# Altium schematic sheet MAIN_BOARD.SchDoc
size E; SheetNumber: 1; SheetTotal: 13
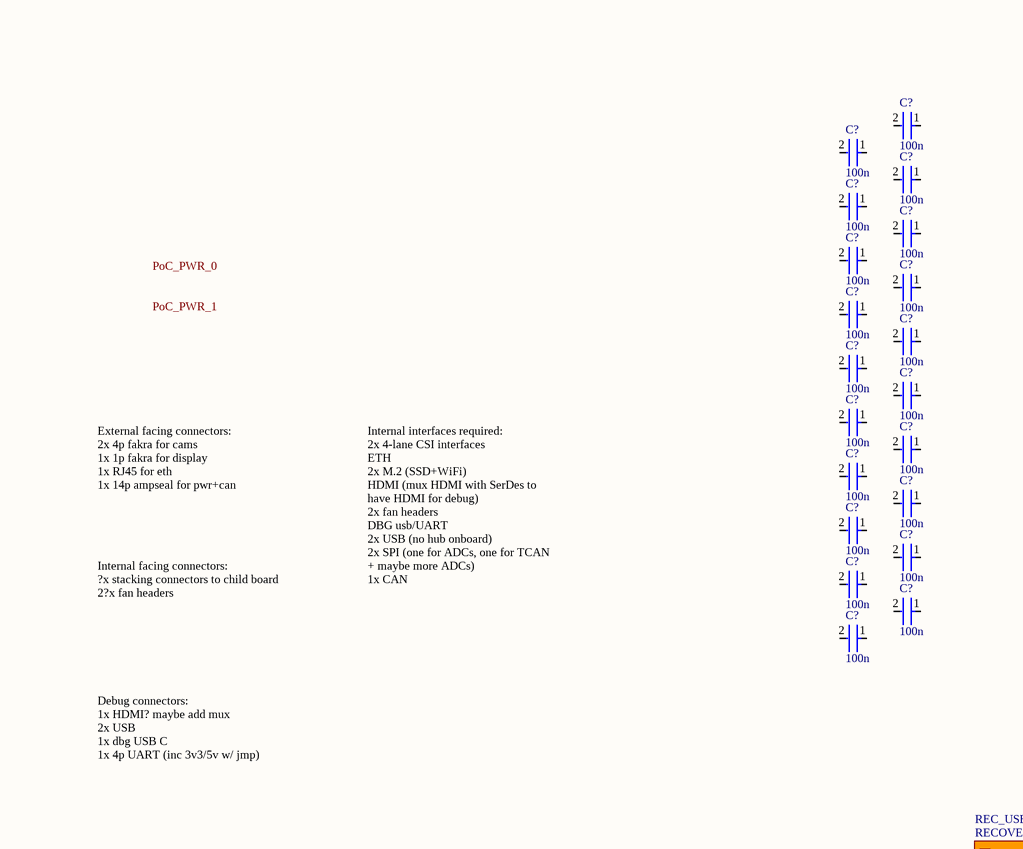
[diagram p0: MAIN_BOARD.SchDoc, top left]
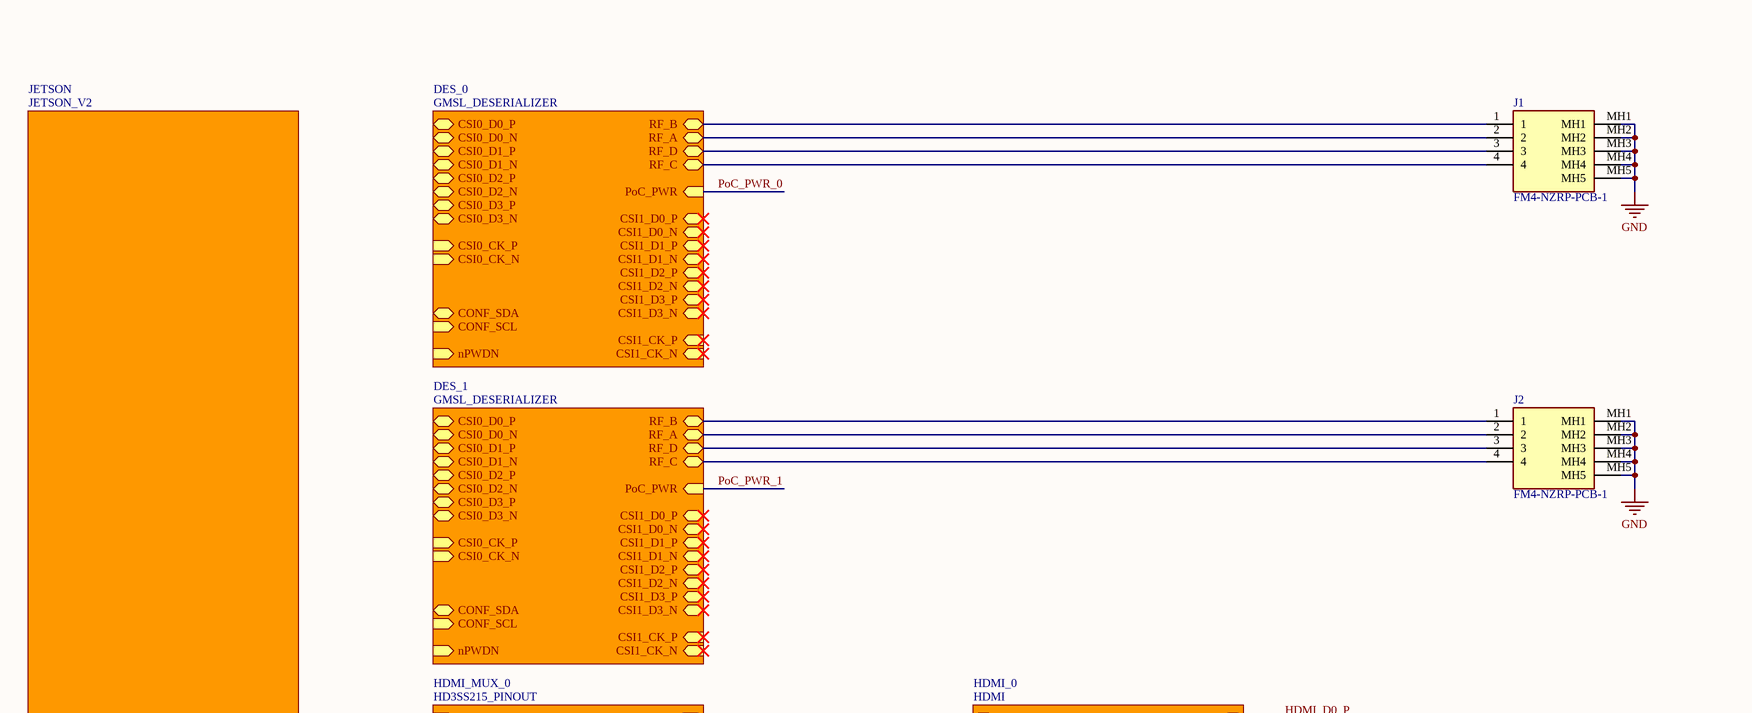
[diagram p1: MAIN_BOARD.SchDoc, top middle]
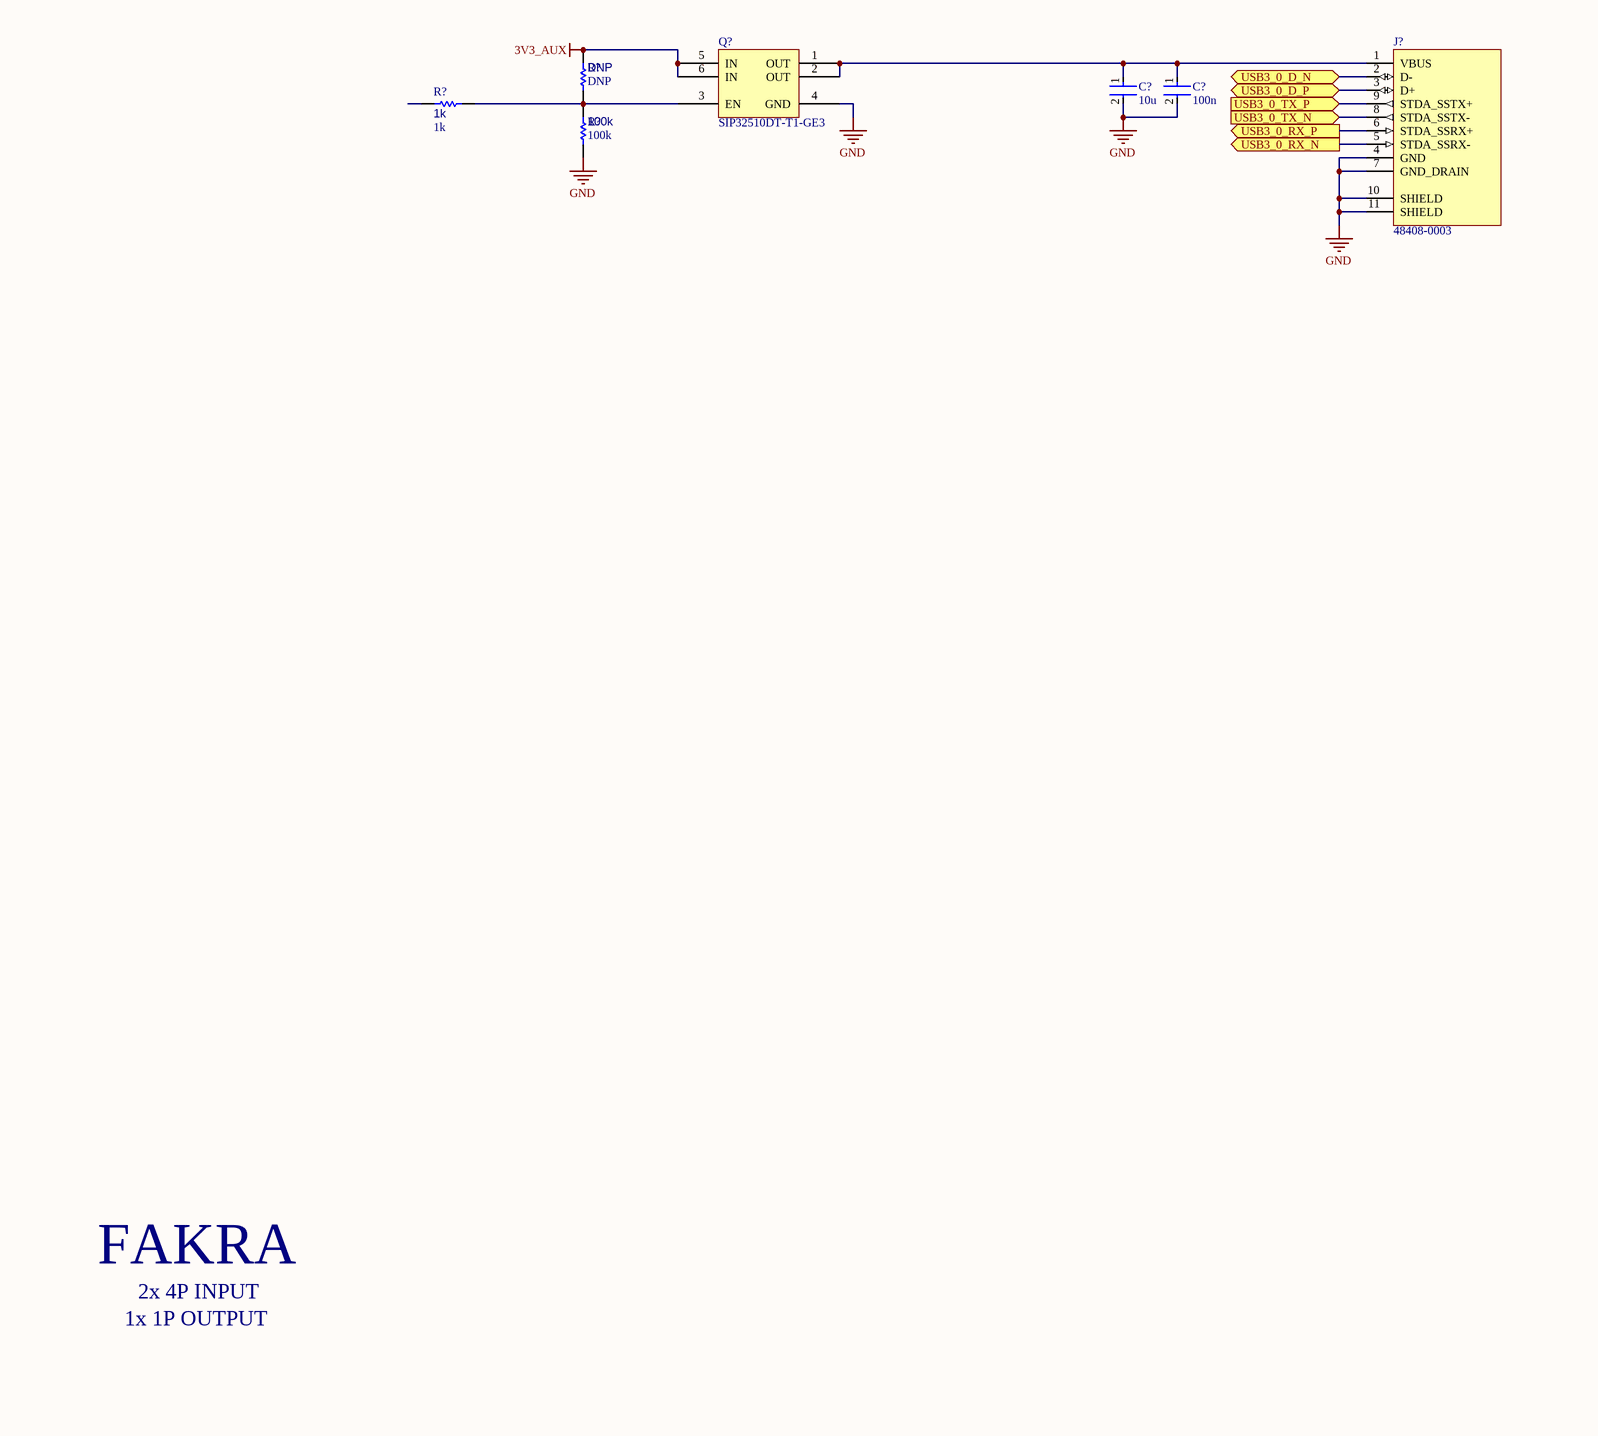
[diagram p2: MAIN_BOARD.SchDoc, top right]
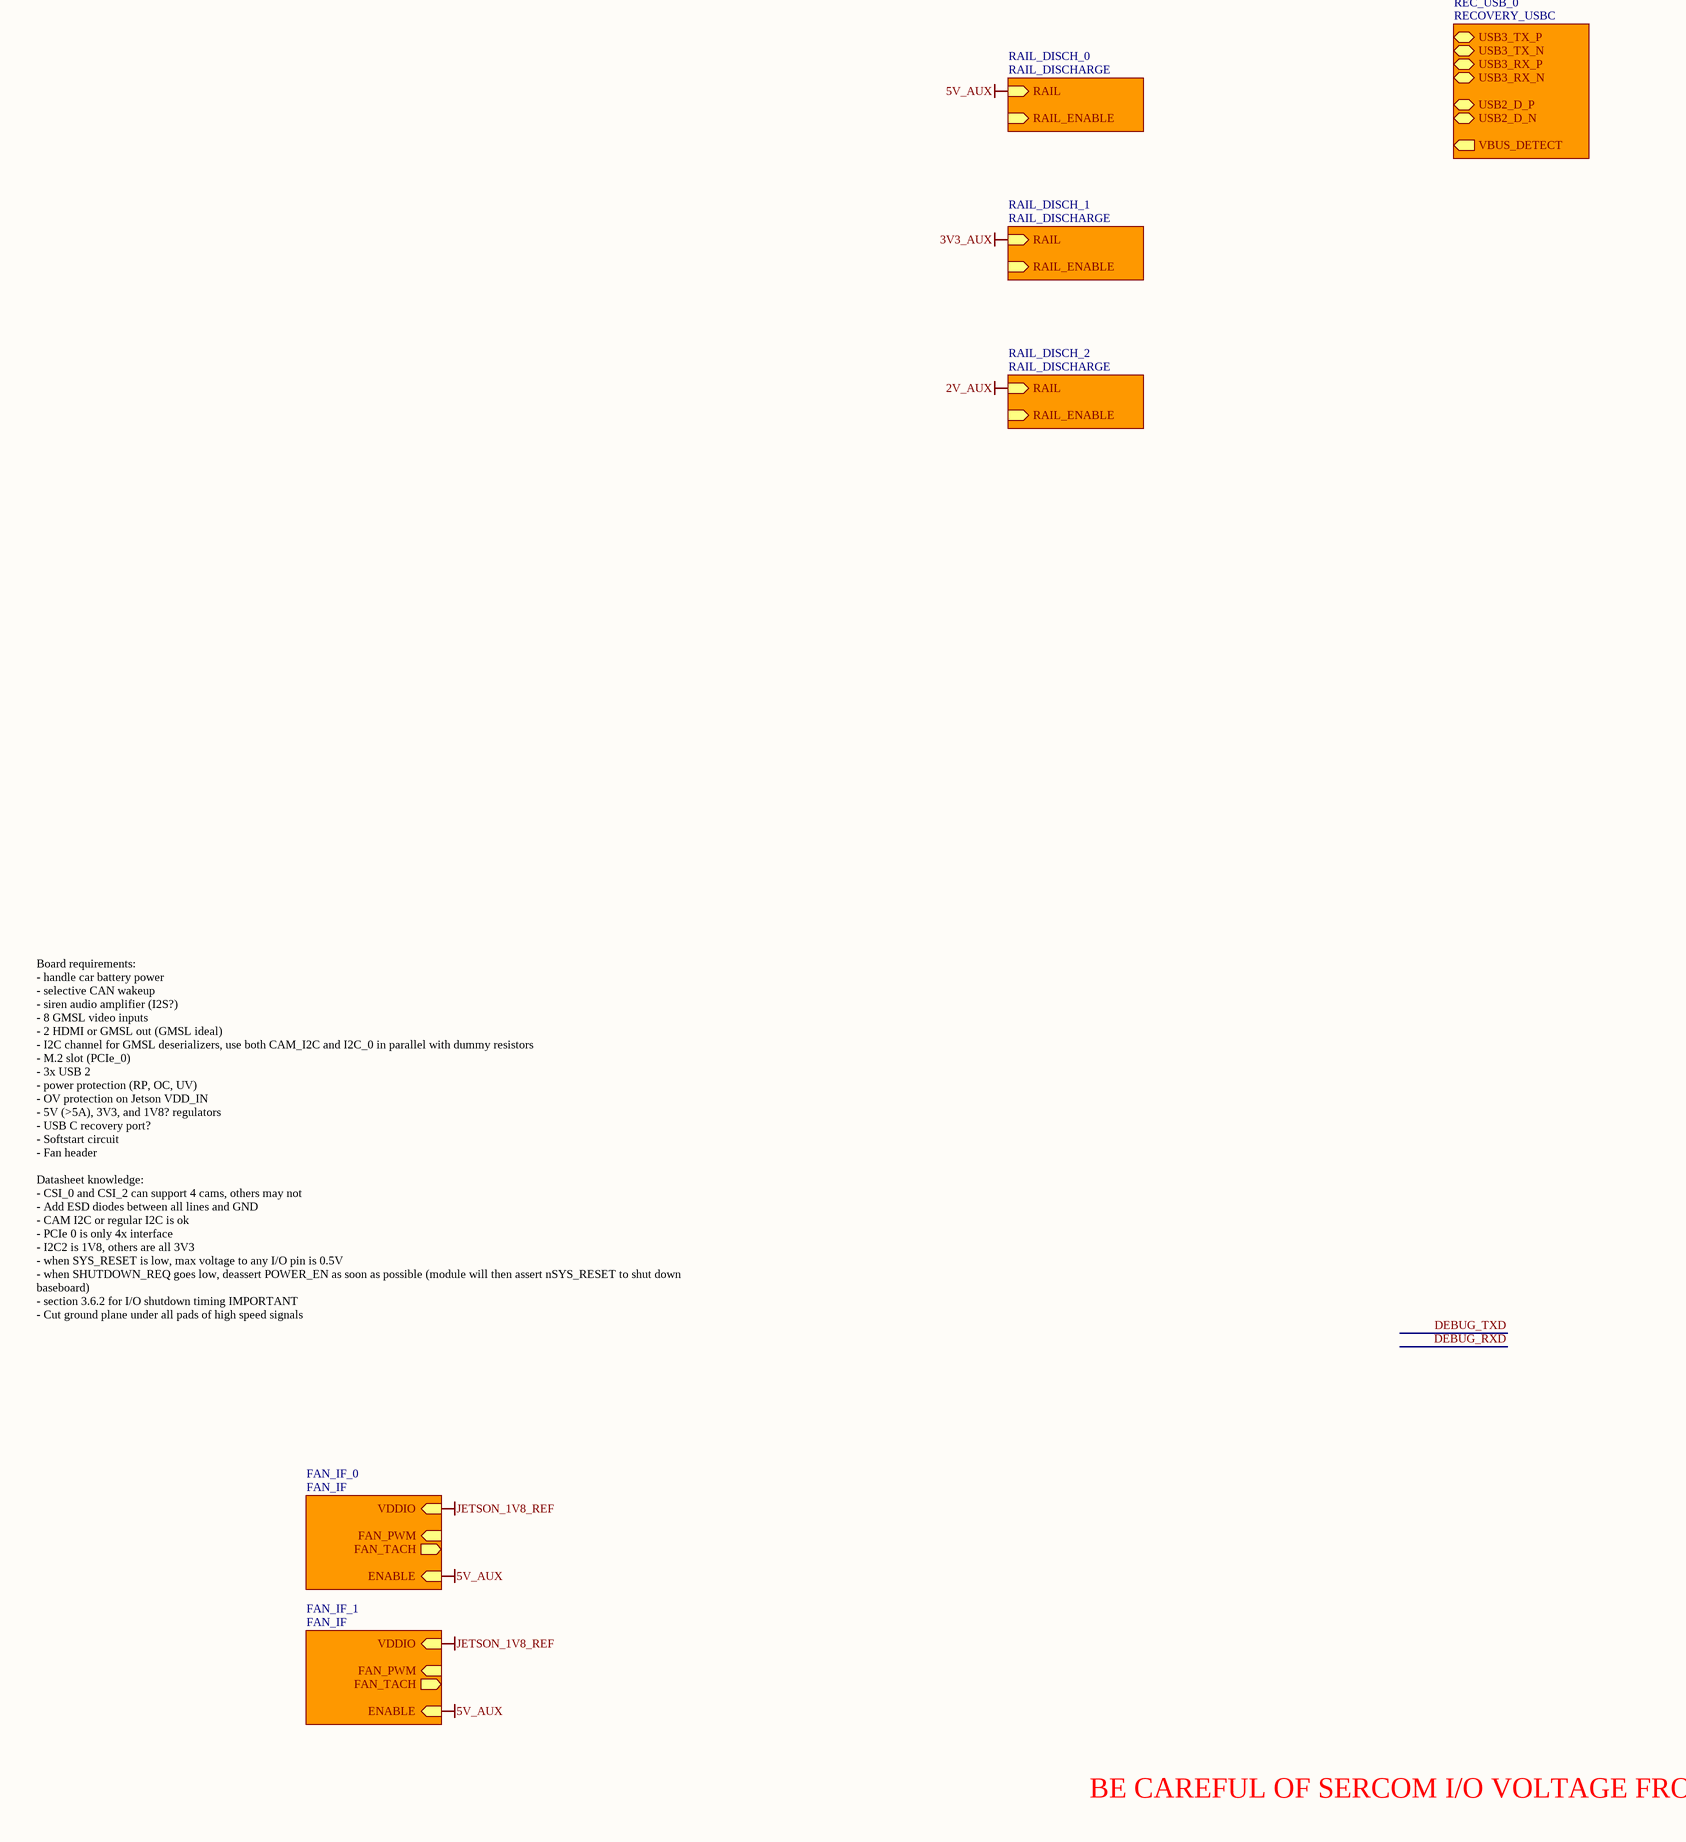
[diagram p3: MAIN_BOARD.SchDoc, bottom left]
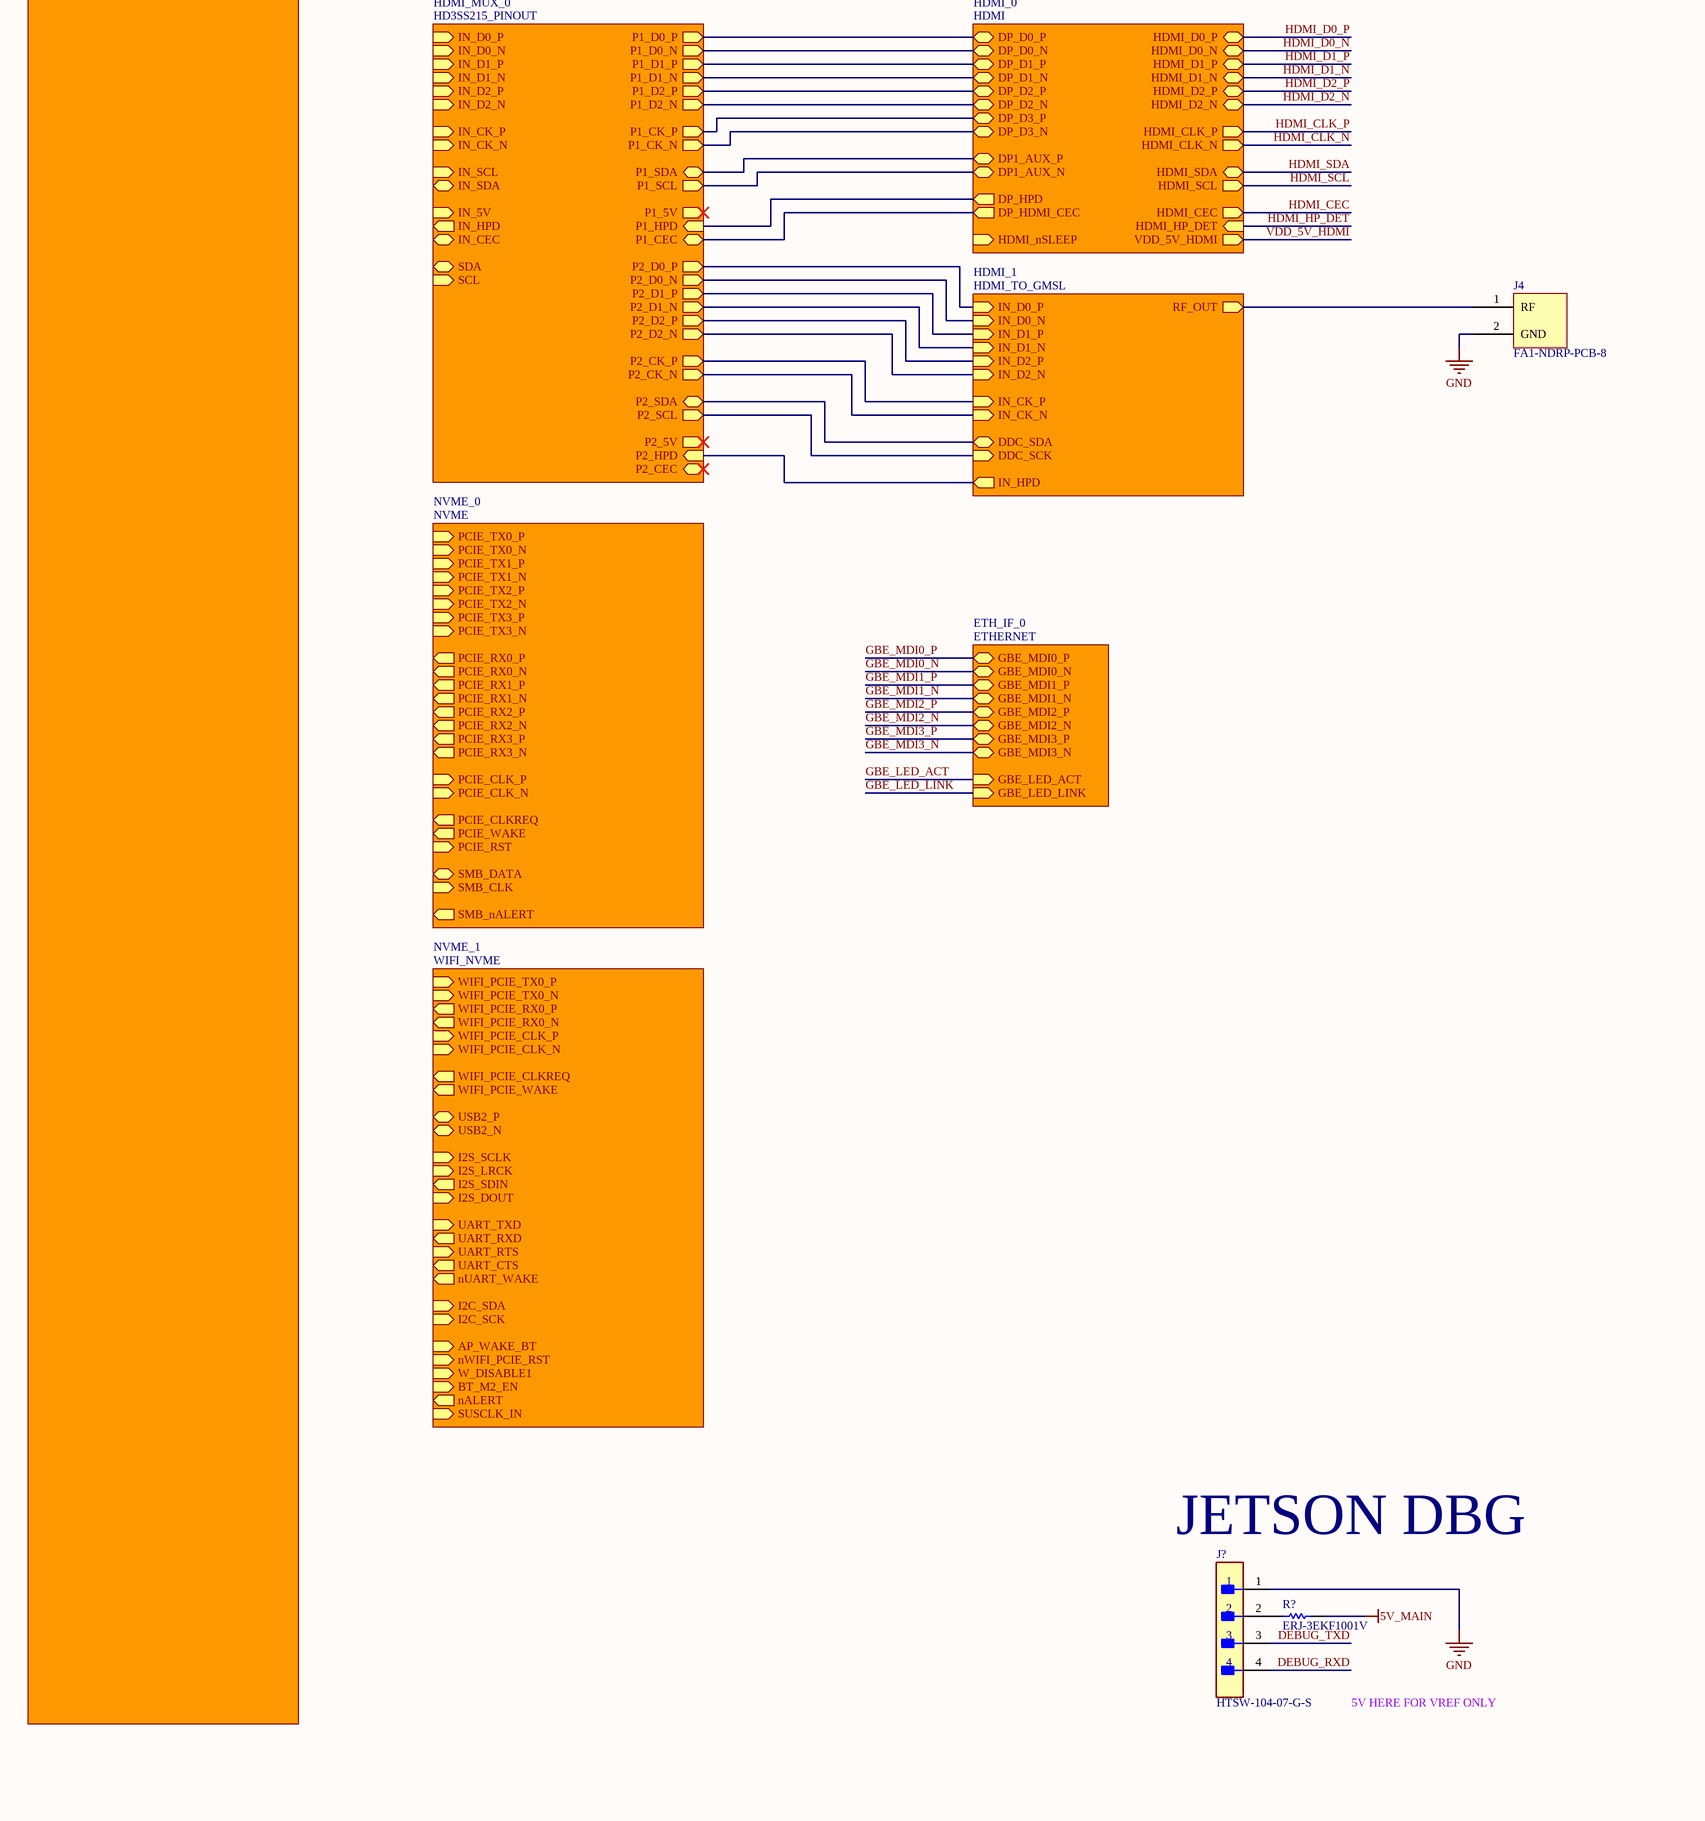
[diagram p4: MAIN_BOARD.SchDoc, bottom middle]
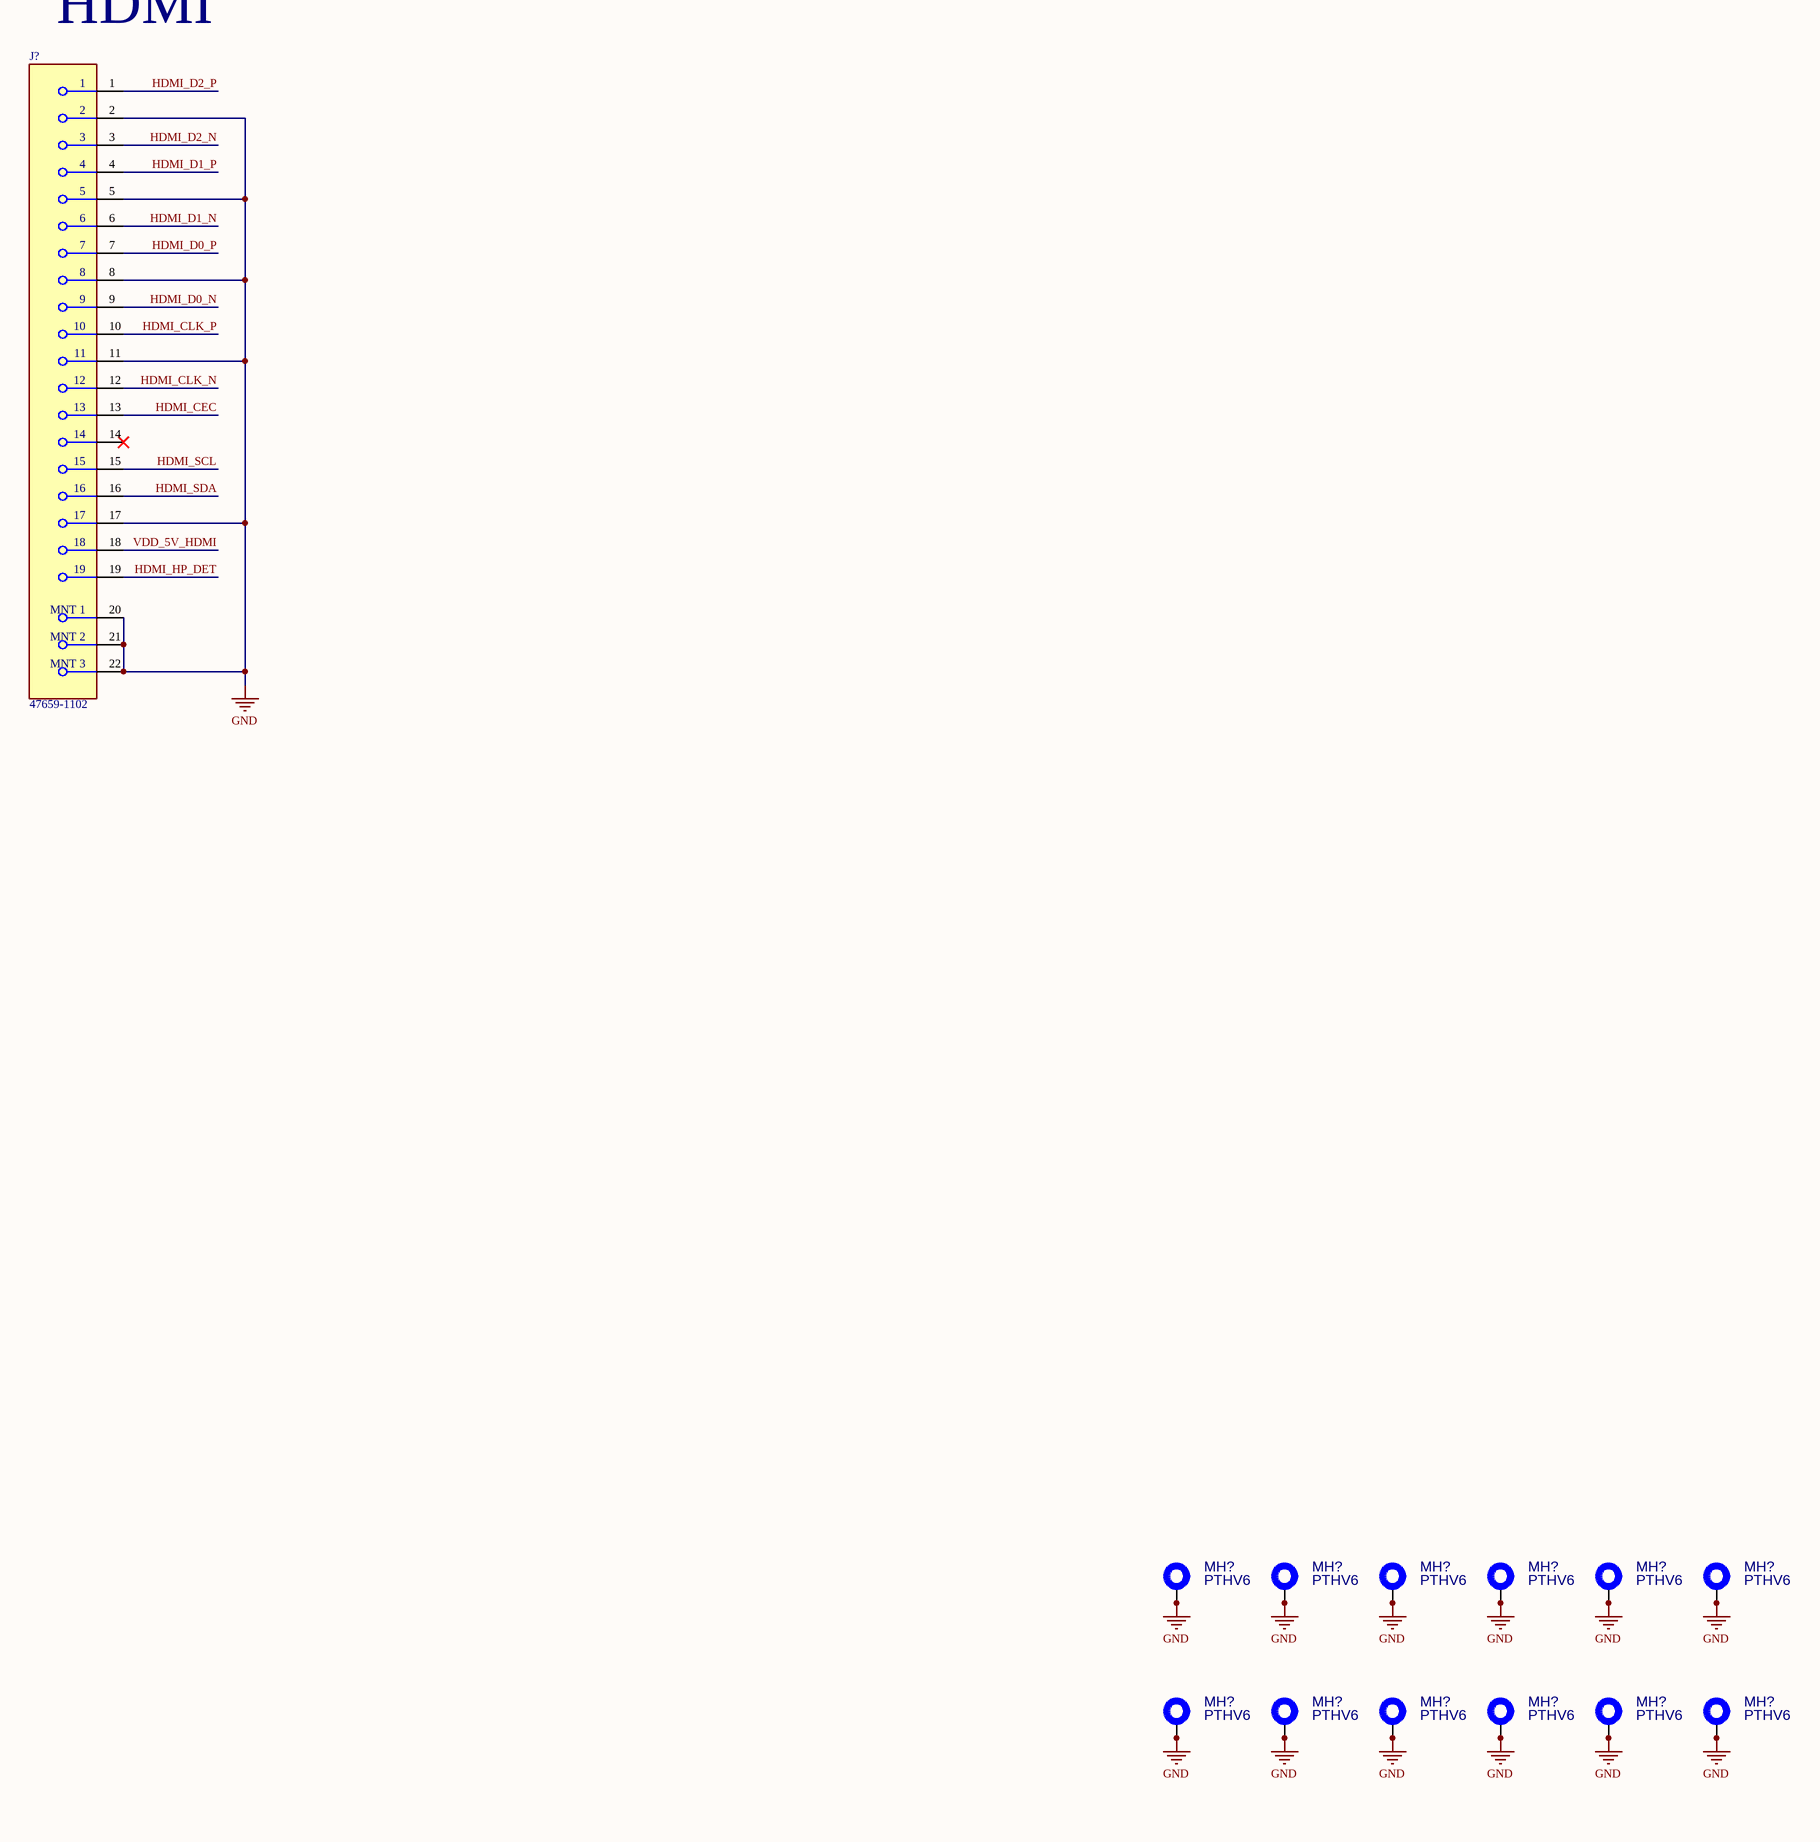
[diagram p5: MAIN_BOARD.SchDoc, bottom right]

## Parts
(Parts that share a designator on the sheet are numbered #1, #2 ... from top to bottom, then left to right.)
C?#1  10u  [FP-0402-L_1_0_0_05-W_0_5-IPC_A]
C?#2  100n  [FP-0402-L_1_0_0_05-W_0_5-IPC_A]
C?#3  100n  [FP-0402-L_1_0_0_05-W_0_5-IPC_A]
C?#4  100n  [FP-0402-L_1_0_0_05-W_0_5-IPC_A]
C?#5  100n  [FP-0402-L_1_0_0_05-W_0_5-IPC_A]
C?#6  100n  [FP-0402-L_1_0_0_05-W_0_5-IPC_A]
C?#7  100n  [FP-0402-L_1_0_0_05-W_0_5-IPC_A]
C?#8  100n  [FP-0402-L_1_0_0_05-W_0_5-IPC_A]
C?#9  100n  [FP-0402-L_1_0_0_05-W_0_5-IPC_A]
C?#10  100n  [FP-0402-L_1_0_0_05-W_0_5-IPC_A]
C?#11  100n  [FP-0402-L_1_0_0_05-W_0_5-IPC_A]
C?#12  100n  [FP-0402-L_1_0_0_05-W_0_5-IPC_A]
C?#13  100n  [FP-0402-L_1_0_0_05-W_0_5-IPC_A]
C?#14  100n  [FP-0402-L_1_0_0_05-W_0_5-IPC_A]
C?#15  100n  [FP-0402-L_1_0_0_05-W_0_5-IPC_A]
C?#16  100n  [FP-0402-L_1_0_0_05-W_0_5-IPC_A]
C?#17  100n  [FP-0402-L_1_0_0_05-W_0_5-IPC_A]
C?#18  100n  [FP-0402-L_1_0_0_05-W_0_5-IPC_A]
C?#19  100n  [FP-0402-L_1_0_0_05-W_0_5-IPC_A]
C?#20  100n  [FP-0402-L_1_0_0_05-W_0_5-IPC_A]
C?#21  100n  [FP-0402-L_1_0_0_05-W_0_5-IPC_A]
C?#22  100n  [FP-0402-L_1_0_0_05-W_0_5-IPC_A]
J1  FM4-NZRP-PCB-1  [FM4-NZRP-PCB-1-Footprint-1]
J2  FM4-NZRP-PCB-1  [FM4-NZRP-PCB-1-Footprint-1]
J4  FA1-NDRP-PCB-8  [FA1-NDRP-PCB-8-Footprint-1]
J?#1  48408-0003  [MOLX-48408-0003_V]
J?#2  47659-1102  [FP-47659-1102-MFG]
J?#3  HTSW-104-07-G-S  [FP-HTSW-104-07-G-S-MFG]
MH?#1  PTHV6  [PTHV6 M2]  (net tie, no BOM)
MH?#2  PTHV6  [PTHV6 M2]  (net tie, no BOM)
MH?#3  PTHV6  [PTHV6 M2]  (net tie, no BOM)
MH?#4  PTHV6  [PTHV6 M2]  (net tie, no BOM)
MH?#5  PTHV6  [PTHV6 M2]  (net tie, no BOM)
MH?#6  PTHV6  [PTHV6 M2]  (net tie, no BOM)
MH?#7  PTHV6  [PTHV6 M2]  (net tie, no BOM)
MH?#8  PTHV6  [PTHV6 M2]  (net tie, no BOM)
MH?#9  PTHV6  [PTHV6 M2]  (net tie, no BOM)
MH?#10  PTHV6  [PTHV6 M2]  (net tie, no BOM)
MH?#11  PTHV6  [PTHV6 M2]  (net tie, no BOM)
MH?#12  PTHV6  [PTHV6 M2]  (net tie, no BOM)
Q?  SIP32510DT-T1-GE3  [SOT95P284X110-6N]
R?#1  DNP  [R0603B]
R?#2  1k  [R0603B]
R?#3  100k  [R0603B]
R?#4  ERJ-3EKF1001V  [RESC1608X55X30LL15T15]

## Sub-sheets
DES_0 = GMSL_DESERIALIZER: CSI0_D0_P (bidir), CSI0_D0_N (bidir), CSI0_D1_P (bidir), CSI0_D1_N (bidir), CSI0_D2_P (bidir), CSI0_D2_N (bidir), CSI0_D3_P (bidir), CSI0_D3_N (bidir), CSI0_CK_P (in), CSI0_CK_N (in), PoC_PWR (in), RF_B (bidir), RF_A (bidir), RF_C (bidir), RF_D (bidir), CSI1_D0_P (bidir), CSI1_D0_N (bidir), CSI1_D1_P (bidir), CSI1_D1_N (bidir), CSI1_D2_P (bidir), CSI1_D2_N (bidir), CSI1_D3_P (bidir), CSI1_D3_N (bidir), CSI1_CK_P (in), CSI1_CK_N (in), nPWDN (in), CONF_SDA (bidir), CONF_SCL (in)
DES_1 = GMSL_DESERIALIZER: CSI0_D0_P (bidir), CSI0_D0_N (bidir), CSI0_D1_P (bidir), CSI0_D1_N (bidir), CSI0_D2_P (bidir), CSI0_D2_N (bidir), CSI0_D3_P (bidir), CSI0_D3_N (bidir), CSI0_CK_P (in), CSI0_CK_N (in), PoC_PWR (in), RF_B (bidir), RF_A (bidir), RF_C (bidir), RF_D (bidir), CSI1_D0_P (bidir), CSI1_D0_N (bidir), CSI1_D1_P (bidir), CSI1_D1_N (bidir), CSI1_D2_P (bidir), CSI1_D2_N (bidir), CSI1_D3_P (bidir), CSI1_D3_N (bidir), CSI1_CK_P (in), CSI1_CK_N (in), nPWDN (in), CONF_SDA (bidir), CONF_SCL (in)
ETH_IF_0 = ETHERNET: GBE_MDI0_P (bidir), GBE_MDI0_N (bidir), GBE_MDI1_P (bidir), GBE_MDI1_N (bidir), GBE_MDI2_P (bidir), GBE_MDI2_N (bidir), GBE_MDI3_P (bidir), GBE_MDI3_N (bidir), GBE_LED_ACT (in), GBE_LED_LINK (in)
FAN_IF_0 = FAN_IF: FAN_PWM (in), FAN_TACH (out), VDDIO (in), ENABLE (in)
FAN_IF_1 = FAN_IF: FAN_PWM (in), FAN_TACH (out), VDDIO (in), ENABLE (in)
HDMI_0 = HDMI: DP_D0_P (bidir), DP_D0_N (bidir), DP_D1_P (bidir), DP_D1_N (bidir), DP_D2_P (bidir), DP_D2_N (bidir), DP_D3_P (bidir), DP_D3_N (bidir), DP1_AUX_P (bidir), DP1_AUX_N (bidir), DP_HDMI_CEC (out), DP_HPD (out), HDMI_nSLEEP (in), HDMI_D0_P (bidir), HDMI_D0_N (bidir), HDMI_D1_P (bidir), HDMI_D1_N (bidir), HDMI_D2_P (bidir), HDMI_D2_N (bidir), HDMI_CLK_P (out), HDMI_CLK_N (out), HDMI_SDA (bidir), HDMI_SCL (out), HDMI_CEC (out), HDMI_HP_DET (in), VDD_5V_HDMI (out)
HDMI_1 = HDMI_TO_GMSL: IN_D0_P (in), IN_D0_N (in), IN_D1_P (in), IN_D1_N (in), IN_D2_P (in), IN_D2_N (in), IN_CK_N (in), IN_CK_P (in), DDC_SCK (in), DDC_SDA (bidir), IN_HPD (out), RF_OUT (out)
HDMI_MUX_0 = HD3SS215_PINOUT: IN_D0_P (in), IN_D0_N (in), IN_D1_P (in), IN_D1_N (in), IN_D2_P (in), IN_D2_N (in), IN_CK_N (in), IN_CK_P (in), IN_SCL (in), IN_SDA (bidir), IN_5V (in), IN_HPD (out), IN_CEC (bidir), P1_D0_P (out), P1_D0_N (out), P1_D1_P (out), P1_D1_N (out), P1_D2_P (out), P1_D2_N (out), P1_CK_P (out), P1_CK_N (out), P1_SDA (bidir), P1_SCL (out), P1_5V (out), P1_HPD (in), P1_CEC (bidir), P2_D0_P (out), P2_D0_N (out), P2_D1_P (out), P2_D1_N (out), P2_D2_P (out), P2_D2_N (out), P2_CK_P (out), P2_CK_N (out), SDA (bidir), SCL (in), P2_SDA (bidir), P2_SCL (out), P2_5V (out), P2_HPD (in), P2_CEC (bidir)
JETSON = JETSON_V2: no entries
NVME_0 = NVME: SMB_DATA (bidir), SMB_CLK (in), SMB_nALERT (out), PCIE_TX3_N (in), PCIE_TX3_P (in), PCIE_TX2_N (in), PCIE_TX2_P (in), PCIE_TX1_N (in), PCIE_TX1_P (in), PCIE_TX0_N (in), PCIE_TX0_P (in), PCIE_RX3_N (out), PCIE_RX3_P (out), PCIE_RX2_N (out), PCIE_RX2_P (out), PCIE_RX1_N (out), PCIE_RX1_P (out), PCIE_RX0_N (out), PCIE_RX0_P (out), PCIE_CLK_N (in), PCIE_CLK_P (in), PCIE_RST (in), PCIE_CLKREQ (out), PCIE_WAKE (out)
NVME_1 = WIFI_NVME: WIFI_PCIE_TX0_P (in), WIFI_PCIE_TX0_N (in), WIFI_PCIE_RX0_P (out), WIFI_PCIE_RX0_N (out), WIFI_PCIE_CLK_P (in), WIFI_PCIE_CLK_N (in), WIFI_PCIE_CLKREQ (out), WIFI_PCIE_WAKE (out), USB2_P (bidir), USB2_N (bidir), I2S_SCLK (in), I2S_LRCK (in), I2S_SDIN (out), I2S_DOUT (in), nUART_WAKE (out), UART_RXD (out), UART_TXD (in), UART_RTS (in), UART_CTS (out), AP_WAKE_BT (in), SUSCLK_IN (in), I2C_SCK (in), I2C_SDA (in), nALERT (out), nWIFI_PCIE_RST (in), W_DISABLE1 (in), BT_M2_EN (in)
RAIL_DISCH_0 = RAIL_DISCHARGE: RAIL (in), RAIL_ENABLE (in)
RAIL_DISCH_1 = RAIL_DISCHARGE: RAIL (in), RAIL_ENABLE (in)
RAIL_DISCH_2 = RAIL_DISCHARGE: RAIL (in), RAIL_ENABLE (in)
REC_USB_0 = RECOVERY_USBC: VBUS_DETECT (out), USB3_TX_P (bidir), USB3_TX_N (bidir), USB3_RX_P (bidir), USB3_RX_N (bidir), USB2_D_P (bidir), USB2_D_N (bidir)

## Ports
USB3_0_D_N (bidir), USB3_0_D_P (bidir), USB3_0_RX_N (out), USB3_0_RX_P (out), USB3_0_TX_N (in), USB3_0_TX_P (in)

## Nets
2V_AUX: sheet RAIL_DISCH_2/RAIL
3V3_AUX: Q?.5(IN) Q?.6(IN) R?#1.2 ; sheet RAIL_DISCH_1/RAIL
5V_AUX: sheet FAN_IF_0/ENABLE, sheet FAN_IF_1/ENABLE, sheet RAIL_DISCH_0/RAIL
5V_MAIN: R?#4.1
GND: C?#1.2 C?#2.2 J1.MH1 J1.MH2 J1.MH3 J1.MH4 J1.MH5 J2.MH1 J2.MH2 J2.MH3 J2.MH4 J2.MH5 J4.2(GND) J?#1.4(GND) J?#1.7(GND_DRAIN) J?#1.10(SHIELD) J?#1.11(SHIELD) J?#2.2 J?#2.5 J?#2.8 J?#2.11 J?#2.17 J?#2.20(MNT_1) J?#2.21(MNT_2) J?#2.22(MNT_3) J?#3.1 MH?#1.1(MH) MH?#1.2(V1) MH?#1.3(V2) MH?#1.4(V3) MH?#1.5(V4) MH?#1.6(V5) MH?#1.7(V6) MH?#2.1(MH) MH?#2.2(V1) MH?#2.3(V2) MH?#2.4(V3) MH?#2.5(V4) MH?#2.6(V5) MH?#2.7(V6) MH?#3.1(MH) MH?#3.2(V1) MH?#3.3(V2) MH?#3.4(V3) MH?#3.5(V4) MH?#3.6(V5) MH?#3.7(V6) MH?#4.1(MH) MH?#4.2(V1) MH?#4.3(V2) MH?#4.4(V3) MH?#4.5(V4) MH?#4.6(V5) MH?#4.7(V6) MH?#5.1(MH) MH?#5.2(V1) MH?#5.3(V2) MH?#5.4(V3) MH?#5.5(V4) MH?#5.6(V5) MH?#5.7(V6) MH?#6.1(MH) MH?#6.2(V1) MH?#6.3(V2) MH?#6.4(V3) MH?#6.5(V4) MH?#6.6(V5) MH?#6.7(V6) MH?#7.1(MH) MH?#7.2(V1) MH?#7.3(V2) MH?#7.4(V3) MH?#7.5(V4) MH?#7.6(V5) MH?#7.7(V6) MH?#8.1(MH) MH?#8.2(V1) MH?#8.3(V2) MH?#8.4(V3) MH?#8.5(V4) MH?#8.6(V5) MH?#8.7(V6) MH?#9.1(MH) MH?#9.2(V1) MH?#9.3(V2) MH?#9.4(V3) MH?#9.5(V4) MH?#9.6(V5) MH?#9.7(V6) MH?#10.1(MH) MH?#10.2(V1) MH?#10.3(V2) MH?#10.4(V3) MH?#10.5(V4) MH?#10.6(V5) MH?#10.7(V6) MH?#11.1(MH) MH?#11.2(V1) MH?#11.3(V2) MH?#11.4(V3) MH?#11.5(V4) MH?#11.6(V5) MH?#11.7(V6) MH?#12.1(MH) MH?#12.2(V1) MH?#12.3(V2) MH?#12.4(V3) MH?#12.5(V4) MH?#12.6(V5) MH?#12.7(V6) Q?.4(GND) R?#3.1
JETSON_1V8_REF: sheet FAN_IF_0/VDDIO, sheet FAN_IF_1/VDDIO
DEBUG_RXD: J?#3.4
DEBUG_TXD: J?#3.3
GBE_LED_ACT: sheet ETH_IF_0/GBE_LED_ACT
GBE_LED_LINK: sheet ETH_IF_0/GBE_LED_LINK
GBE_MDI0_N: sheet ETH_IF_0/GBE_MDI0_N
GBE_MDI0_P: sheet ETH_IF_0/GBE_MDI0_P
GBE_MDI1_N: sheet ETH_IF_0/GBE_MDI1_N
GBE_MDI1_P: sheet ETH_IF_0/GBE_MDI1_P
GBE_MDI2_N: sheet ETH_IF_0/GBE_MDI2_N
GBE_MDI2_P: sheet ETH_IF_0/GBE_MDI2_P
GBE_MDI3_N: sheet ETH_IF_0/GBE_MDI3_N
GBE_MDI3_P: sheet ETH_IF_0/GBE_MDI3_P
HDMI_CEC: J?#2.13 ; sheet HDMI_0/HDMI_CEC
HDMI_CLK_N: J?#2.12 ; sheet HDMI_0/HDMI_CLK_N
HDMI_CLK_P: J?#2.10 ; sheet HDMI_0/HDMI_CLK_P
HDMI_D0_N: J?#2.9 ; sheet HDMI_0/HDMI_D0_N
HDMI_D0_P: J?#2.7 ; sheet HDMI_0/HDMI_D0_P
HDMI_D1_N: J?#2.6 ; sheet HDMI_0/HDMI_D1_N
HDMI_D1_P: J?#2.4 ; sheet HDMI_0/HDMI_D1_P
HDMI_D2_N: J?#2.3 ; sheet HDMI_0/HDMI_D2_N
HDMI_D2_P: J?#2.1 ; sheet HDMI_0/HDMI_D2_P
HDMI_HP_DET: J?#2.19 ; sheet HDMI_0/HDMI_HP_DET
HDMI_SCL: J?#2.15 ; sheet HDMI_0/HDMI_SCL
HDMI_SDA: J?#2.16 ; sheet HDMI_0/HDMI_SDA
PoC_PWR_0: sheet DES_0/PoC_PWR
PoC_PWR_1: sheet DES_1/PoC_PWR
USB3_0_D_N: J?#1.2(D-) ; port USB3_0_D_N
USB3_0_D_P: J?#1.3(D+) ; port USB3_0_D_P
USB3_0_RX_N: J?#1.5(STDA_SSRX-) ; port USB3_0_RX_N
USB3_0_RX_P: J?#1.6(STDA_SSRX+) ; port USB3_0_RX_P
USB3_0_TX_N: J?#1.8(STDA_SSTX-) ; port USB3_0_TX_N
USB3_0_TX_P: J?#1.9(STDA_SSTX+) ; port USB3_0_TX_P
VDD_5V_HDMI: J?#2.18 ; sheet HDMI_0/VDD_5V_HDMI
NetC?#1_1: C?#1.1 C?#2.1 J?#1.1(VBUS) Q?.1(OUT) Q?.2(OUT)
NetJ1_1: J1.1 ; sheet DES_0/RF_B
NetJ1_2: J1.2 ; sheet DES_0/RF_A
NetJ1_3: J1.3 ; sheet DES_0/RF_D
NetJ1_4: J1.4 ; sheet DES_0/RF_C
NetJ2_1: J2.1 ; sheet DES_1/RF_B
NetJ2_2: J2.2 ; sheet DES_1/RF_A
NetJ2_3: J2.3 ; sheet DES_1/RF_D
NetJ2_4: J2.4 ; sheet DES_1/RF_C
NetJ4_1: J4.1(RF) ; sheet HDMI_1/RF_OUT
NetJ?#3_2: J?#3.2 R?#4.2
NetQ?_3: Q?.3(EN) R?#1.1 R?#2.1 R?#3.2
(unnamed): sheet HDMI_0/DP_D0_P, sheet HDMI_MUX_0/P1_D0_P
(unnamed): sheet HDMI_0/DP_D0_N, sheet HDMI_MUX_0/P1_D0_N
(unnamed): sheet HDMI_0/DP_D1_P, sheet HDMI_MUX_0/P1_D1_P
(unnamed): sheet HDMI_0/DP_D1_N, sheet HDMI_MUX_0/P1_D1_N
(unnamed): sheet HDMI_0/DP_D2_P, sheet HDMI_MUX_0/P1_D2_P
(unnamed): sheet HDMI_0/DP_D2_N, sheet HDMI_MUX_0/P1_D2_N
(unnamed): sheet HDMI_0/DP_D3_P, sheet HDMI_MUX_0/P1_CK_P
(unnamed): sheet HDMI_0/DP_D3_N, sheet HDMI_MUX_0/P1_CK_N
(unnamed): sheet HDMI_0/DP1_AUX_P, sheet HDMI_MUX_0/P1_SDA
(unnamed): sheet HDMI_0/DP1_AUX_N, sheet HDMI_MUX_0/P1_SCL
(unnamed): sheet HDMI_0/DP_HDMI_CEC, sheet HDMI_MUX_0/P1_CEC
(unnamed): sheet HDMI_0/DP_HPD, sheet HDMI_MUX_0/P1_HPD
(unnamed): sheet HDMI_1/IN_D0_P, sheet HDMI_MUX_0/P2_D0_P
(unnamed): sheet HDMI_1/IN_D0_N, sheet HDMI_MUX_0/P2_D0_N
(unnamed): sheet HDMI_1/IN_D1_P, sheet HDMI_MUX_0/P2_D1_P
(unnamed): sheet HDMI_1/IN_D1_N, sheet HDMI_MUX_0/P2_D1_N
(unnamed): sheet HDMI_1/IN_D2_P, sheet HDMI_MUX_0/P2_D2_P
(unnamed): sheet HDMI_1/IN_D2_N, sheet HDMI_MUX_0/P2_D2_N
(unnamed): sheet HDMI_1/IN_CK_N, sheet HDMI_MUX_0/P2_CK_N
(unnamed): sheet HDMI_1/IN_CK_P, sheet HDMI_MUX_0/P2_CK_P
(unnamed): sheet HDMI_1/DDC_SCK, sheet HDMI_MUX_0/P2_SCL
(unnamed): sheet HDMI_1/DDC_SDA, sheet HDMI_MUX_0/P2_SDA
(unnamed): sheet HDMI_1/IN_HPD, sheet HDMI_MUX_0/P2_HPD

Not connected (* = marked no-connect by the designer): C?#3 1 2; C?#4 1 2; C?#5 1 2; C?#6 1 2; C?#7 1 2; C?#8 1 2; C?#9 1 2; C?#10 1 2; C?#11 1 2; C?#12 1 2; C?#13 1 2; C?#14 1 2; C?#15 1 2; C?#16 1 2; C?#17 1 2; C?#18 1 2; C?#19 1 2; C?#20 1 2; C?#21 1 2; C?#22 1 2; J?#2 14*; R?#2 2

## Notes on the sheet
- FAKRA
- 2x 4P INPUT
- 1x 1P OUTPUT
- External facing connectors:
  2x 4p fakra for cams
  1x 1p fakra for display
  1x RJ45 for eth
  1x 14p ampseal for pwr+can
- Internal facing connectors:
  ?x stacking connectors to child board
  2?x fan headers
- HDMI
- Internal interfaces required:
  2x 4-lane CSI interfaces
  ETH
  2x M.2 (SSD+WiFi)
  HDMI (mux HDMI with SerDes to have HDMI for debug)
  2x fan headers
  DBG usb/UART
  2x USB (no hub onboard)
  2x SPI (one for ADCs, one for TCAN + maybe more ADCs)
  1x CAN
- Debug connectors:
  1x HDMI? maybe add mux
  2x USB
  1x dbg USB C
  1x 4p UART (inc 3v3/5v w/ jmp)
- Board requirements:
  - handle car battery power
  - selective CAN wakeup
  - siren audio amplifier (I2S?)
  - 8 GMSL video inputs
  - 2 HDMI or GMSL out (GMSL ideal)
  - I2C channel for GMSL deserializers, use both CAM_I2C and I2C_0 in parallel with dummy resistors
  - M.2 slot (PCIe_0)
  - 3x USB 2
  - power protection (RP, OC, UV)
  - OV protection on Jetson VDD_IN
  - 5V (>5A), 3V3, and 1V8? regulators
  - USB C recovery port?
  - Softstart circuit
  - Fan header
  Datasheet knowledge:
  - CSI_0 and CSI_2 can support 4 cams, others may not
  - Add ESD diodes between all lines and GND
  - CAM I2C or regular I2C is ok
  - PCIe 0 is only 4x interface
  - I2C2 is 1V8, others are all 3V3
  - when SYS_RESET is low, max voltage to any I/O pin is 0.5V
  - when SHUTDOWN_REQ goes low, deassert POWER_EN as soon as possible (module will then assert nSYS_RESET to shut down baseboard)
  - section 3.6.2 for I/O shutdown timing IMPORTANT
  - Cut ground plane under all pads of high speed signals
- (near J?#3) JETSON DBG
- 5V HERE FOR VREF ONLY
- BE CAREFUL OF SERCOM I/O VOLTAGE FROM JETSON
- Labels drawn without touching a wire or pin: PoC_PWR_0, PoC_PWR_1

## Library data of the parts
C?#1-C?#22 = CMP-001-00058-1: LARGE PADS, 0402 CAP, CHANGE COMMENT TO MATCH REAL P/N; Capacitor Type: Ceramic; Min Operating Temperature: -55°C; Mounting Technology: Surface Mount; Pins: 2; Case/Package: 0402; RoHS Compliant: Yes; Max Operating Temperature: 85°C
J1 J2 = CMP-002-00044-4: Connector RF Mini-FAKRA Plug 9GHz 50Ohm Solder Right Angle Through Hole; Source: fakra4ch.SchLib; Component Type: Standard; Pins: 9; Design Item ID: CMP-002-00085-1
J4 = CMP-002-00054-1: RF F Connector, Male, Board Mount, Solder Terminal, Plug; Connector Type: RF F CONNECTOR; RoHS Compliant: Yes; Mounting Technology: Board
J?#1 = CMP-0411-00003-1: Universal Serial Bus (USB 3.0) I/O Connector, Vertical, Type A, Through Hole, 9 Circuits, -20 to 85 degC, RoHS, Tray; No. of Positions: 9; No. of Rows: 2; Packing: Tray; Orientation: Vertical; ComponentLink3Description: Package Specification; ComponentLink2URL: http://www.molex.com/webdocs/datasheets/pdf/en-us/0484080003_IO_CONNECTORS.pdf; ComponentLink3URL: http://www.molex.com/pdm_docs/sd/484080003_sd.pdf; ComponentLink1Description: Manufacturer URL; PackageVersion: Rev. F, 12/2012; Mounting Technology: Through Hole; Temperature Min: -20 degC; ComponentLink2Description: Datasheet; PackageDescription: 9-Pin USB 3.0 I/O Receptacle, Vertical, Height 15.25 mm, Through Hole; PartNumber: 48408-0003; Temperature Max: 85 degC; RoHS: TRUE; ComponentLink1URL: http://www.molex.com/
J?#2 = CMP-04768-000010-1: HDMI REC.VERTICAL SMT TYPE W/HEI; RoHS Compliant: Yes
J?#3 = CMP-02766-001776-1: CONN HEADER VERT 4POS 2.54MM; Gender: Male; Number of Contacts: 4; Packaging: Bulk; RoHS Compliant: Yes; Number of Rows: 1; Mount: Through Hole; Contact Material: Bronze; Series: HTSW; Radiation Hardening: No; Pitch: 2.54mm; Reach SVHC Compliant: Yes; Contact Plating: Gold; Termination: Through Hole
MH?#1-MH?#12 = CMP-00028-00001-11: Plated mounting hole with 6 peripheral vias. This is a generic symbol that groups all relevant footprints.
Q? = CMP-019-00054-1: Power Switch ICs – Power Distribution; VISHAY; SIP32510DT-T1-GE3; 1; 1; 5.5 V; SOT-23-6; Max Supply Voltage: 5.5V; Max Power Dissipation: 833mW; Min Supply Voltage: 1.2V; Case/Package: SOT-23-6; Mounting Technology: Surface Mount; Max Operating Temperature: 85°C; Min Operating Temperature: -40°C
R?#1-R?#3 = CMP-009-00002-14: Resistor
  R?#1: Value: DNP
  R?#2: Value: 1k
  R?#3: Value: 100k
R?#4 = CMP-2000-00180-1: Manufacturer: Panasonic; Part Number: ERJ-3EKF1001V